# Altium schematic sheet power_REG104GA_3V3.SchDoc
size A4
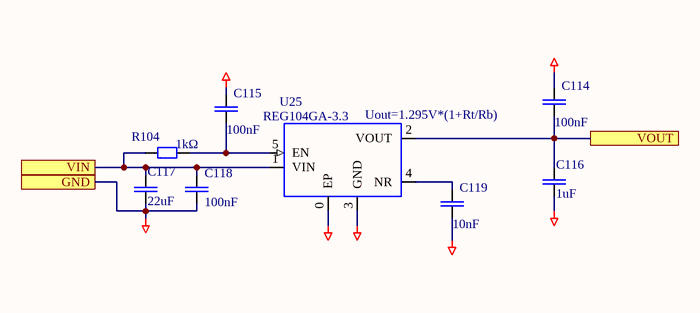
[diagram p0: power_REG104GA_3V3.SchDoc]

## Parts
C114  100nF  [CAPC1608N]
C115  100nF  [CAPC1608N]
C116  1uF  [CAPC2012N]
C117  22uF  [CAPC2012N]
C118  100nF  [CAPC1608N]
C119  10nF  [CAPC1608N]
R104  1kΩ  [RESC2012N]
U25  REG104GA-3.3  [SOT223]

## Ports
GND, VIN, VOUT

## Nets
GND: C114.2 C115.2 C116.1 C117.1 C118.1 C119.1 U25.0(EP) U25.3(GND) ; port GND
VIN: C117.2 C118.2 R104.2 U25.1(VIN) ; port VIN
VOUT: C114.1 C116.2 U25.2(VOUT) ; port VOUT
NetC115_1: C115.1 R104.1 U25.5(EN)
NetC119_2: C119.2 U25.4(NR)

## Notes on the sheet
- (near U25) Uout=1.295V*(1+Rt/Rb)

## Library data of the parts
C114 C115 C118 C119 = CAPC: Generic ceramic SMD capacitor; Pkg: 0603; Maintainer: Evgeniy Kotov; SMD Solders: 2; THD Solders: 0; Last Change Data: 06.03.2017; Release Date: 06.03.2017
  C114 C115 C118: PartField: 100nF; Value: 100nF
  C119: PartField: 10nF; Value: 10nF
C116 C117 = CAPC: Generic ceramic SMD capacitor; Pkg: 0805; Maintainer: Evgeniy Kotov; SMD Solders: 2; THD Solders: 0; Voltage Rating: 10V; Last Change Data: 06.03.2017; Release Date: 06.03.2017
  C116: PartField: 1uF; Value: 1uF
  C117: PartField: 22uF; Value: 22uF
R104 = RESC: Resistor, Generic, SMD; PartField: 150Ω; Pkg: 0805; Maintainer: Evgeniy Kotov; SMD Solders: 2; THD Solders: 0; Release Date: 06.03.2017; Last Change Data: 09.03.2017; Value: 1kΩ
U25 = REG104GA-3.3: Single Output LDO, 1.0A, Fixed (3.3V), Low Noise, Fast Transient Response; Manufacturer: Texas Instruments; Manufacturer_Part_Number: reg104-33_dcq_6; INDUSTRY_STD_PKG_TYPE: SOT-223; FAMILY_NAME: SINGLE CHANNEL LDO; PIN_COUNT: 6; PACKAGE_DESIGNATOR: DCQ; Pkg: SOT-5EP; THD Solders: 0; Value: REG104GA-3.3; Datasheet URL: http://www.ti.com/lit/gpn/REG104-A; GENERIC_PART_NUMBER: REG104GA-3.3; Vendor: Texas Instruments; SMD Solders: 6; PartField: REG104GA-3.3